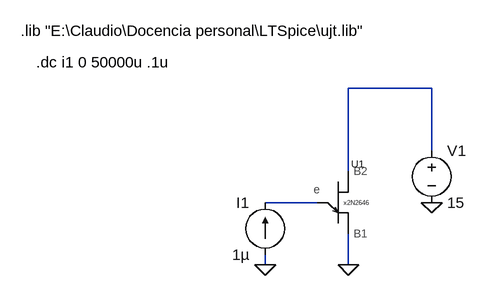
[diagram p0: schematic ujt1.asc]
ujt1.asc, the LTspice schematic file:
Version 4
SHEET 1 1588 1236
WIRE 768 64 640 64
WIRE 768 160 768 64
WIRE 640 192 640 64
WIRE 592 240 512 240
WIRE 512 336 512 320
WIRE 640 336 640 288
FLAG 768 240 0
FLAG 512 336 0
FLAG 640 336 0
SYMBOL voltage 768 144 R0
WINDOW 123 0 0 Left 0
WINDOW 39 0 0 Left 0
SYMATTR InstName V1
SYMATTR Value 15
SYMBOL nujt 624 240 R0
SYMATTR Value x2N2646
SYMATTR InstName U1
SYMBOL current 512 320 R180
WINDOW 0 24 80 Left 2
WINDOW 3 24 0 Left 2
WINDOW 123 0 0 Left 0
WINDOW 39 0 0 Left 0
SYMATTR InstName I1
SYMATTR Value 1µ
TEXT 136 -24 Left 2 !.lib "E:\\Claudio\\Docencia personal\\LTSpice\\ujt.lib"
TEXT 160 24 Left 2 !.dc i1 0 50000u .1u

The netlist it stands for:
* ujt1.asc
V1 N001 0 15
XU1 N002 0 N001 x2N2646  ; pins e B1 B2
I1 0 N002 1µ
.lib "E:\Claudio\Docencia personal\LTSpice\ujt.lib"
.dc i1 0 50000u .1u
.backanno
.end